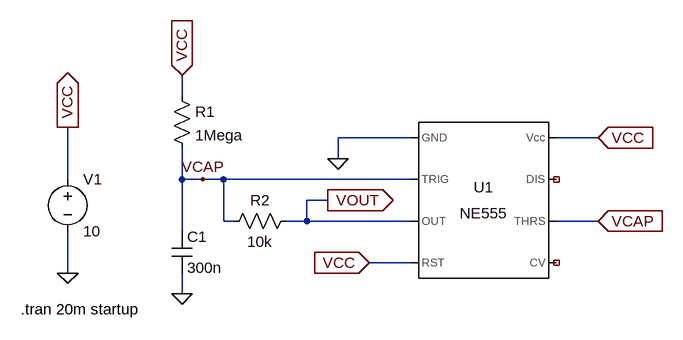
[diagram p0: schematic Square Wave Generator Using Timer 555.asc]
Square Wave Generator Using Timer 555.asc, the LTspice schematic file:
Version 4
SHEET 1 1784 680
WIRE 704 -512 704 -544
WIRE 1056 -448 944 -448
WIRE 1344 -448 1280 -448
WIRE 944 -416 944 -448
WIRE 528 -384 528 -464
WIRE 704 -384 704 -432
WIRE 736 -384 704 -384
WIRE 768 -384 736 -384
WIRE 1056 -384 768 -384
WIRE 928 -352 896 -352
WIRE 768 -320 768 -384
WIRE 784 -320 768 -320
WIRE 896 -320 896 -352
WIRE 896 -320 864 -320
WIRE 1056 -320 896 -320
WIRE 1344 -320 1280 -320
WIRE 704 -304 704 -384
WIRE 1056 -256 992 -256
WIRE 528 -240 528 -304
WIRE 704 -208 704 -240
FLAG 704 -208 0
FLAG 528 -240 0
FLAG 528 -464 VCC
IOPIN 528 -464 Out
FLAG 704 -544 VCC
IOPIN 704 -544 In
FLAG 1344 -448 VCC
IOPIN 1344 -448 In
FLAG 992 -256 VCC
IOPIN 992 -256 In
FLAG 944 -416 0
FLAG 736 -384 VCAP
FLAG 1344 -320 VCAP
IOPIN 1344 -320 In
FLAG 928 -352 VOUT
IOPIN 928 -352 Out
SYMBOL Misc\\NE555 1168 -352 R0
SYMATTR InstName U1
SYMBOL cap 688 -304 R0
SYMATTR InstName C1
SYMATTR Value 300n
SYMBOL res 688 -528 R0
SYMATTR InstName R1
SYMATTR Value 1Mega
SYMBOL voltage 528 -400 R0
WINDOW 123 0 0 Left 0
WINDOW 39 0 0 Left 0
SYMATTR InstName V1
SYMATTR Value 10
SYMBOL res 880 -336 R90
WINDOW 0 0 56 VBottom 2
WINDOW 3 32 56 VTop 2
SYMATTR InstName R2
SYMATTR Value 10k
TEXT 456 -184 Left 2 !.tran 20m startup

The netlist it stands for:
* Square Wave Generator Using Timer 555.asc
XU1 0 VCAP VOUT VCC NC_01 VCAP NC_02 VCC NE555  ; pins GND TRIG OUT RST CV THRS DIS Vcc
C1 VCAP 0 300n
R1 VCC VCAP 1Mega
V1 VCC 0 10
R2 VOUT VCAP 10k
.tran 20m startup
.lib NE555.sub
.backanno
.end